# Altium schematic sheet Ate_RF_Sch.SchDoc
size A3; Organization0: INDÚSTRIA DE MATERIAL BÉLICO DO BRASIL; Organization2: FÁBRICA DE MATERIAL DE; Organization3: COMUNICAÇÕES E ELETRÔNICA; Organization1: VINCULADA AO EXÉRCITO BRASILEIRO; Esquematico: Esquemático
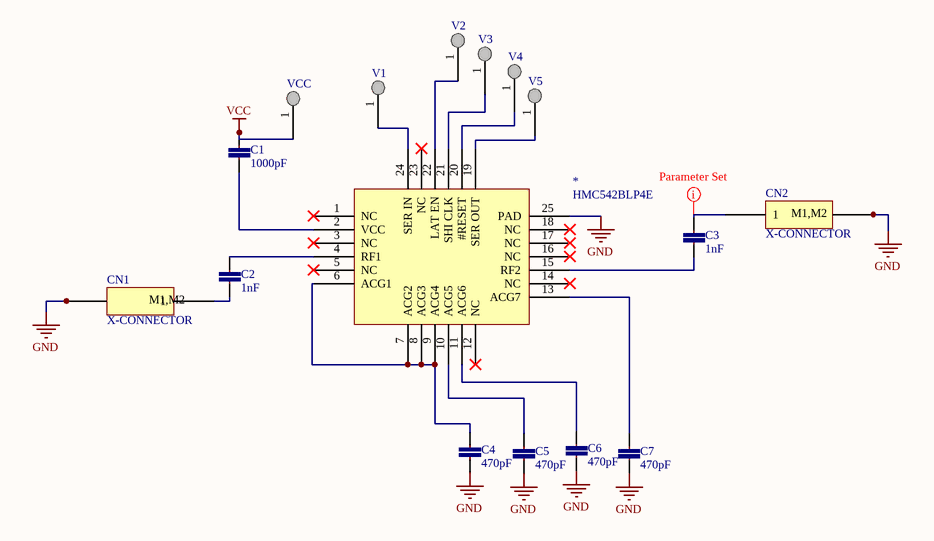
[diagram p0: Ate_RF_Sch.SchDoc]

## Parts
*  HMC542BLP4E  [QFN50P400X400X80_HS-25N]
C1  1000pF  [CAPC0603(1608)55_L]
C2  1nF  [0402-CAP]
C3  1nF  [0402-CAP]
C4  470pF  [0402-CAP]
C5  470pF  [0402-CAP]
C6  470pF  [0402-CAP]
C7  470pF  [0402-CAP]
CN1  X-CONNECTOR  [X-CONNECTOR-PCB]
CN2  X-CONNECTOR  [X-CONNECTOR-PCB]
V1  TEST_VIA_RF  [New footprint 1]  (value not drawn)
V2  TEST_VIA_RF  [New footprint 1]  (value not drawn)
V3  TEST_VIA_RF  [New footprint 1]  (value not drawn)
V4  TEST_VIA_RF  [New footprint 1]  (value not drawn)
V5  TEST_VIA_RF  [New footprint 1]  (value not drawn)
VCC  TEST_VIA_RF  [New footprint 1]  (value not drawn)

## Nets
GND: *.25(PAD) C4.2 C5.2 C6.2 C7.2 CN1.M1 CN1.M2 CN2.M1 CN2.M2
VCC: C1.1 VCC.1
Net*_2: *.2(VCC) C1.2
Net*_4: *.4(RF1) C2.1
Net*_6: *.6(ACG1) *.7(ACG2) *.8(ACG3) *.9(ACG4) C4.1
Net*_10: *.10(ACG5) C5.1
Net*_11: *.11(ACG6) C6.1
Net*_13: *.13(ACG7) C7.1
Net*_15: *.15(RF2) C3.2
Net*_19: *.19(SER_OUT) V5.1
Net*_20: *.20(#RESET) V4.1
Net*_21: *.21(SHI_CLK) V3.1
Net*_22: *.22(LAT_EN) V2.1
Net*_24: *.24(SER_IN) V1.1
NetC2_2: C2.2 CN1.1
NetC3_1: C3.1 CN2.1

Not connected (* = marked no-connect by the designer): * 1(NC)* 3(NC)* 5(NC)* 12(NC)* 14(NC)* 16(NC)* 17(NC)* 18(NC)* 23(NC)*

## Layout directives
net class 50ohm: NetC3_1

## Notes on the sheet
- USADO EQUIP.:
- DATA:
- ENG:
- VERIF:
- HORA:
- REV:
- APROV:
- TÍTULO:
- FOLHA:
- /
- FORMATO:
- A3
- CÓDIGO:
- ESTOQUE:
- (in symbol X-CONNECTOR-5) M1,M2

## Library data of the parts
* = HMC542BLP4E-01.A.1: Attenuators DATT, 0.5 dB LSB 6 Bit (Hitt Controller); Insertion Loss: 1.9dB; Impedance: 50R; Number of Channels: 1; Min Supply Voltage: 4.5V; Operating Supply Voltage: 5V; Max Supply Voltage: 5.5V; Attenuation Value: 31.5dB; Max Frequency: 4GHz; Max Power Dissipation: 560mW; Number of Bits: 6; Weight: 0.032741oz; Package Quantity: 50; Packaging: Cut Tape; Contact Plating: Tin,Matte; Lead Free: Contains Lead; Mount: Surface Mount; Max Operating Temperature: 85°C; Case/Package: QFN; Number of Pins: 24; Min Operating Temperature: -40°C; REACH SVHC: No SVHC
C1 = CC0603-1000pF-1: CAP CER 1000PF 50V C0G/NP0 0603; Part No: GRM1885C1H102JA01D; Value: 1000p
C2 C3 = CC0402-1nF-7: CAP CER 1000pF 25V 10% X7R 0402; Part No: VJ0402Y562KNAAJ; Cod EMS: 05.281.006.134; Value: 1n
C4-C7 = CC0402-470pF-1: CAP CER 470PF 50V C0G/NP0 0402; Part No: GRM1555C1H471JA01D; Value: 470pF
CN1 CN2 = X-CONNECTOR-5: CONECTOR PARA MÓDULOS X MICROWAVE; RoHS: Yes; Mount: TH
V1-V5 VCC = TEST_VIA_RF-01.A.1: Test VIA for RF circuits